# Altium schematic sheet V1.SchDoc
size A4; Organization: Altium Limited; Address1: L3, 12a Rodborough Rd; Address2: Frenchs Forest; Address3: NSW; Address4: Australia 2086
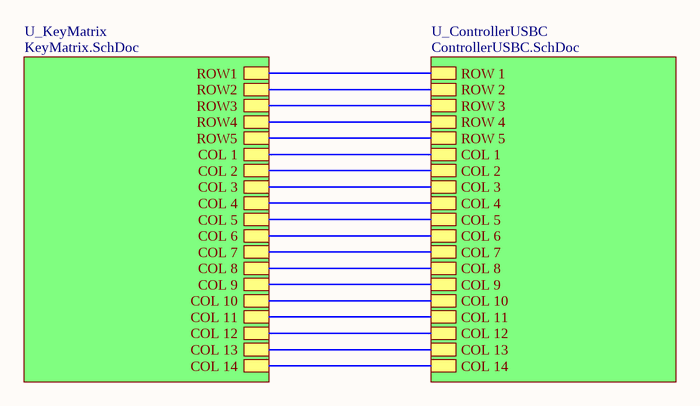
[diagram p0: V1.SchDoc]

## Sub-sheets
U_ControllerUSBC = ControllerUSBC.SchDoc: ROW 1, ROW 2, ROW 3, ROW 4, ROW 5, COL 1, COL 2, COL 3, COL 4, COL 5, COL 6, COL 7, COL 8, COL 9, COL 10, COL 11, COL 12, COL 13, COL 14
U_KeyMatrix = KeyMatrix.SchDoc: ROW1, ROW2, ROW3, ROW4, ROW5, COL 1, COL 2, COL 3, COL 4, COL 5, COL 6, COL 7, COL 8, COL 9, COL 10, COL 11, COL 12, COL 13, COL 14

## Nets
(unnamed): sheet U_ControllerUSBC/ROW 1, sheet U_KeyMatrix/ROW1
(unnamed): sheet U_ControllerUSBC/ROW 2, sheet U_KeyMatrix/ROW2
(unnamed): sheet U_ControllerUSBC/ROW 3, sheet U_KeyMatrix/ROW3
(unnamed): sheet U_ControllerUSBC/ROW 4, sheet U_KeyMatrix/ROW4
(unnamed): sheet U_ControllerUSBC/ROW 5, sheet U_KeyMatrix/ROW5
(unnamed): sheet U_ControllerUSBC/COL 1, sheet U_KeyMatrix/COL 1
(unnamed): sheet U_ControllerUSBC/COL 2, sheet U_KeyMatrix/COL 2
(unnamed): sheet U_ControllerUSBC/COL 3, sheet U_KeyMatrix/COL 3
(unnamed): sheet U_ControllerUSBC/COL 4, sheet U_KeyMatrix/COL 4
(unnamed): sheet U_ControllerUSBC/COL 5, sheet U_KeyMatrix/COL 5
(unnamed): sheet U_ControllerUSBC/COL 6, sheet U_KeyMatrix/COL 6
(unnamed): sheet U_ControllerUSBC/COL 7, sheet U_KeyMatrix/COL 7
(unnamed): sheet U_ControllerUSBC/COL 8, sheet U_KeyMatrix/COL 8
(unnamed): sheet U_ControllerUSBC/COL 9, sheet U_KeyMatrix/COL 9
(unnamed): sheet U_ControllerUSBC/COL 10, sheet U_KeyMatrix/COL 10
(unnamed): sheet U_ControllerUSBC/COL 11, sheet U_KeyMatrix/COL 11
(unnamed): sheet U_ControllerUSBC/COL 12, sheet U_KeyMatrix/COL 12
(unnamed): sheet U_ControllerUSBC/COL 13, sheet U_KeyMatrix/COL 13
(unnamed): sheet U_ControllerUSBC/COL 14, sheet U_KeyMatrix/COL 14

## Notes on the sheet
- Title
- Size:
- Date:
- A4
- Number:
- Time:
- Revision:
- Sheet
- of
- File: